# Altium schematic sheet micro.SchDoc
size A4; SheetNumber: 2; SheetTotal: 4
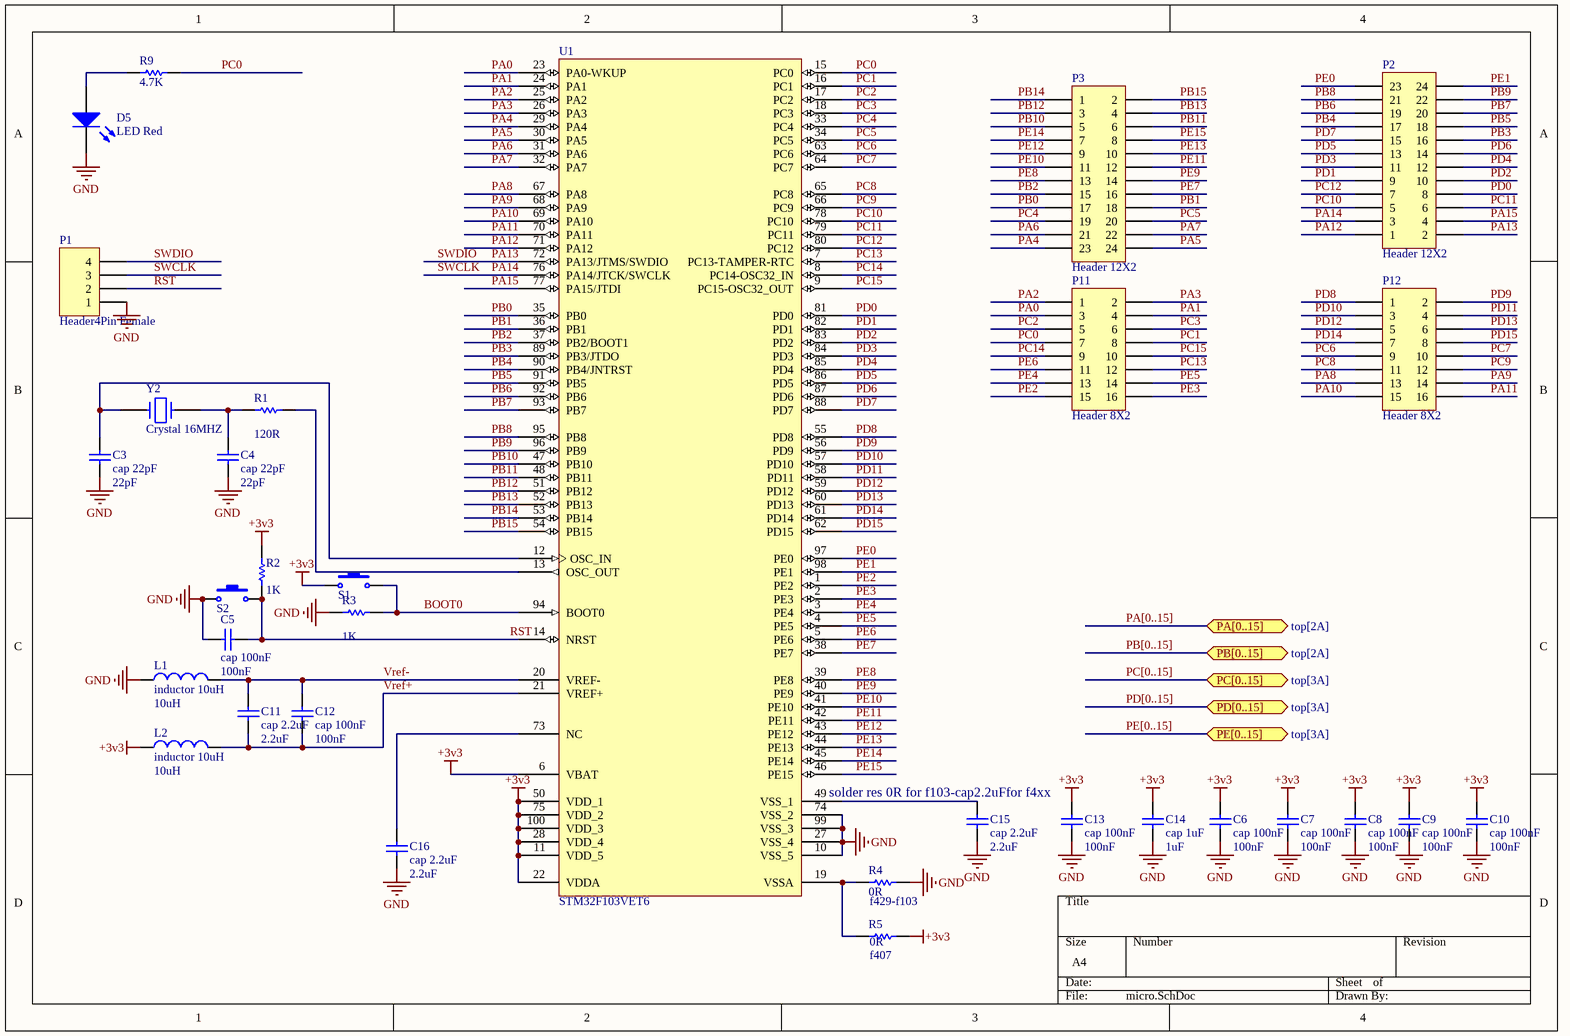
[diagram p0: micro.SchDoc]

## Parts
C3  cap 22pF  value 22pF  [Cap 805]
C4  cap 22pF  value 22pF  [Cap 805]
C5  cap 100nF  value 100nF  [Cap 805]
C6  cap 100nF  value 100nF  [Cap 805]
C7  cap 100nF  value 100nF  [Cap 805]
C8  cap 100nF  value 100nF  [Cap 805]
C9  cap 100nF  value 100nF  [Cap 805]
C10  cap 100nF  value 100nF  [Cap 805]
C11  cap 2.2uF  value 2.2uF  [Cap 805]
C12  cap 100nF  value 100nF  [Cap 805]
C13  cap 100nF  value 100nF  [Cap 805]
C14  cap 1uF  value 1uF  [Cap 805]
C15  cap 2.2uF  value 2.2uF  [Cap 805]
C16  cap 2.2uF  value 2.2uF  [Cap 805]
D5  LED Red  [0805-LED]
L1  inductor 10uH  value 10uH  [IND1206]
L2  inductor 10uH  value 10uH  [IND1206]
P1  Header4Pin Female  [HDR1X4]
P2  Header 12X2  [HDR2X12]
P3  Header 12X2  [HDR2X12]
P11  Header 8X2  [HDR2X8]
P12  Header 8X2  [HDR2X8]
R1  value 120R  [RES 0805 (2012X06L)]  (hidden comment: Res 120R)
R2  value 1K  [RES 0805 (2012X06L)]  (hidden comment: Res 1K)
R3  value 1K  [RES 0805 (2012X06L)]  (hidden comment: Res 1K)
R4  f429-f103  value 0R  [RES 0805 (2012X06L)]
R5  f407  value 0R  [RES 0805 (2012X06L)]
R9  value 4.7K  [RES 0805 (2012X06L)]  (hidden comment: Res 4.7K)
S1  Switch PB  [Switch - Push to On]  (value not drawn)
S2  Switch PB  [Switch - Push to On]  (value not drawn)
U1  STM32F103VET6  [LQFP100_N]
Y2  Crystal 16MHZ  [CRYSTAL Small]

## Ports
PA[0..15] (bidir, see top[2A]), PB[0..15] (bidir, see top[2A]), PC[0..15] (bidir, see top[3A]), PD[0..15] (bidir, see top[3A]), PE[0..15] (bidir, see top[3A])

## Nets
+3v3: C6.2 C7.2 C8.2 C9.2 C10.2 C13.2 C14.2 L2.1 R2.1 R5.2 S1.1 U1.6(VBAT) U1.11(VDD_5) U1.22(VDDA) U1.28(VDD_4) U1.50(VDD_1) U1.75(VDD_2) U1.100(VDD_3)
GND: C3.2 C4.1 C5.2 C6.1 C7.1 C8.1 C9.1 C10.1 C13.1 C14.1 C15.1 C16.1 D5.2(K) L1.1 P1.1 R3.1 R4.1 S2.1 U1.10(VSS_5) U1.27(VSS_4) U1.74(VSS_2) U1.99(VSS_3)
BOOT0: R3.2 S1.2 U1.94(BOOT0)
PA0: P11.3 U1.23(PA0-WKUP)
PA1: P11.4 U1.24(PA1)
PA2: P11.1 U1.25(PA2)
PA3: P11.2 U1.26(PA3)
PA4: P3.23 U1.29(PA4)
PA5: P3.24 U1.30(PA5)
PA6: P3.21 U1.31(PA6)
PA7: P3.22 U1.32(PA7)
PA8: P12.13 U1.67(PA8)
PA9: P12.14 U1.68(PA9)
PA10: P12.15 U1.69(PA10)
PA11: P12.16 U1.70(PA11)
PA12: P2.1 U1.71(PA12)
PA13: P1.4 P2.2 U1.72(PA13/JTMS/SWDIO)  [also labelled SWDIO]
PA14: P1.3 P2.3 U1.76(PA14/JTCK/SWCLK)  [also labelled SWCLK]
PA15: P2.4 U1.77(PA15/JTDI)
PB0: P3.17 U1.35(PB0)
PB1: P3.18 U1.36(PB1)
PB2: P3.15 U1.37(PB2/BOOT1)
PB3: P2.16 U1.89(PB3/JTDO)
PB4: P2.17 U1.90(PB4/JNTRST)
PB5: P2.18 U1.91(PB5)
PB6: P2.19 U1.92(PB6)
PB7: P2.20 U1.93(PB7)
PB8: P2.21 U1.95(PB8)
PB9: P2.22 U1.96(PB9)
PB10: P3.5 U1.47(PB10)
PB11: P3.6 U1.48(PB11)
PB12: P3.3 U1.51(PB12)
PB13: P3.4 U1.52(PB13)
PB14: P3.1 U1.53(PB14)
PB15: P3.2 U1.54(PB15)
PC0: P11.7 R9.1 U1.15(PC0)
PC1: P11.8 U1.16(PC1)
PC2: P11.5 U1.17(PC2)
PC3: P11.6 U1.18(PC3)
PC4: P3.19 U1.33(PC4)
PC5: P3.20 U1.34(PC5)
PC6: P12.9 U1.63(PC6)
PC7: P12.10 U1.64(PC7)
PC8: P12.11 U1.65(PC8)
PC9: P12.12 U1.66(PC9)
PC10: P2.5 U1.78(PC10)
PC11: P2.6 U1.79(PC11)
PC12: P2.7 U1.80(PC12)
PC13: P11.12 U1.7(PC13-TAMPER-RTC)
PC14: P11.9 U1.8(PC14-OSC32_IN)
PC15: P11.10 U1.9(PC15-OSC32_OUT)
PD0: P2.8 U1.81(PD0)
PD1: P2.9 U1.82(PD1)
PD2: P2.10 U1.83(PD2)
PD3: P2.11 U1.84(PD3)
PD4: P2.12 U1.85(PD4)
PD5: P2.13 U1.86(PD5)
PD6: P2.14 U1.87(PD6)
PD7: P2.15 U1.88(PD7)
PD8: P12.1 U1.55(PD8)
PD9: P12.2 U1.56(PD9)
PD10: P12.3 U1.57(PD10)
PD11: P12.4 U1.58(PD11)
PD12: P12.5 U1.59(PD12)
PD13: P12.6 U1.60(PD13)
PD14: P12.7 U1.61(PD14)
PD15: P12.8 U1.62(PD15)
PE0: P2.23 U1.97(PE0)
PE1: P2.24 U1.98(PE1)
PE2: P11.15 U1.1(PE2)
PE3: P11.16 U1.2(PE3)
PE4: P11.13 U1.3(PE4)
PE5: P11.14 U1.4(PE5)
PE6: P11.11 U1.5(PE6)
PE7: P3.16 U1.38(PE7)
PE8: P3.13 U1.39(PE8)
PE9: P3.14 U1.40(PE9)
PE10: P3.11 U1.41(PE10)
PE11: P3.12 U1.42(PE11)
PE12: P3.9 U1.43(PE12)
PE13: P3.10 U1.44(PE13)
PE14: P3.7 U1.45(PE14)
PE15: P3.8 U1.46(PE15)
RST: C5.1 P1.2 R2.2 S2.2 U1.14(NRST)
Vref+: C11.1 C12.1 L2.2 U1.21(VREF+)
Vref-: C11.2 C12.2 L1.2 U1.20(VREF-)
NetC3_1: C3.1 U1.12(OSC_IN) Y2.1
NetC4_2: C4.2 R1.2 Y2.2
NetC15_2: C15.2 U1.49(VSS_1)
NetC16_2: C16.2 U1.73(NC)
NetD5_1: D5.1(A) R9.2
NetR1_1: R1.1 U1.13(OSC_OUT)
NetR4_2: R4.2 R5.1 U1.19(VSSA)

## Buses and harness runs
bus PA[0..15] = port PA[0..15]
bus PB[0..15] = port PB[0..15]
bus PC[0..15] = port PC[0..15]
bus PD[0..15] = port PD[0..15]
bus PE[0..15] = port PE[0..15]

## Notes on the sheet
- solder res 0R for f103-cap2.2uFfor f4xx

## Library data of the parts
C3-C16 = Cap: Capacitor; Published: 8-Jun-2000; LatestRevisionDate: 17-Jul-2002; LatestRevisionNote: Re-released for DXP Platform.; PackageReference: RAD-0.3; Publisher: Altium Limited; PackageDescription: Radial Cap, Thru-Hole; 2 Leads; 0.3 in Pin Spacing
D5 = LED0: LED SMD; pin to pad: 1>A 2>C; Published: 8-Jun-2000; LatestRevisionDate: 08-Jul-2005; LatestRevisionNote: Mech Layer 1 removed.; PackageReference: LED-0; Publisher: Altium Limited; PackageDescription: LED; 2 Leads
L1 L2 = Inductor: Code_IEC: 1005; Published: 8-Jun-2000; LatestRevisionDate: 29-May-2009; LatestRevisionNote: IPC-7351 Footprint Added.; PackageReference: 0402-A; Publisher: Altium Limited; PackageDescription: Chip Inductor; Code_JEITA: 0402
P1 = Header 4: Header, 4-Pin; LatestRevisionDate: 17-Jul-2002; LatestRevisionNote: Re-released for DXP Platform.; Publisher: Altium Limited
P2 P3 = Header 12X2: Header, 12-Pin, Dual row; LatestRevisionDate: 17-Jul-2002; LatestRevisionNote: Re-released for DXP Platform.; Publisher: Altium Limited
P11 P12 = Header 8X2: Header, 8-Pin, Dual row; LatestRevisionDate: 17-Jul-2002; LatestRevisionNote: Re-released for DXP Platform.; Publisher: Altium Limited
R1-R5 R9 = Res1: Resistor; Published: 8-Jun-2000; LatestRevisionDate: 17-Jul-2002; LatestRevisionNote: Re-released for DXP Platform.; PackageReference: AXIAL-0.3; Publisher: Altium Limited; PackageDescription: Axial Device, Thru-Hole; 2 Leads; 0.3 in Pin Spacing
S1 S2 = Switch PB: Push Button Switch
U1 = STM32F103V8T6: STM32 ARM-based 32-bit MCU with 64 Kbytes Flash, 100-pin LQFP, Industrial Temperature; Published: 30-May-2008; DatasheetVersion: rev6, Mar-2008; PackageVersion: Mar-2008; PackageReference: LQFP100; Publisher: Altium Limited; PackageDescription: 100-Pin Low-Profile Quad Flat Pack, 14 x 14 mm Body, 0.5 mm Pitch (LQFP100); ComponentLink1Description: Manufacturer Link; ComponentLink1URL: www.st.com/stm32; ComponentLink2Description: Datasheet; ComponentLink2URL: http://www.st.com/stonline/products/literature/ds/13587.pdf
Y2 = CRYSTAL